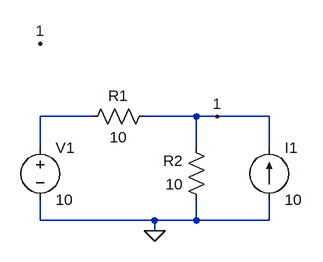
[diagram p0: schematic circuit-3.asc]
circuit-3.asc, the LTspice schematic file:
Version 4
SHEET 1 880 680
WIRE 80 112 0 112
WIRE 240 112 160 112
WIRE 272 112 240 112
WIRE 352 112 272 112
WIRE 0 160 0 112
WIRE 240 160 240 112
WIRE 352 160 352 112
WIRE 0 272 0 240
WIRE 176 272 0 272
WIRE 240 272 240 240
WIRE 240 272 176 272
WIRE 352 272 352 240
WIRE 352 272 240 272
WIRE 176 288 176 272
FLAG 176 288 0
FLAG 272 112 1
FLAG 0 0 1
SYMBOL res 176 96 R90
WINDOW 0 0 56 VBottom 2
WINDOW 3 32 56 VTop 2
SYMATTR InstName R1
SYMATTR Value 10
SYMBOL res 256 256 R180
WINDOW 0 36 76 Left 2
WINDOW 3 36 40 Left 2
SYMATTR InstName R2
SYMATTR Value 10
SYMBOL voltage 0 144 R0
WINDOW 123 0 0 Left 2
WINDOW 39 0 0 Left 2
SYMATTR InstName V1
SYMATTR Value 10
SYMBOL current 352 240 M180
WINDOW 0 24 80 Left 2
WINDOW 3 24 0 Left 2
SYMATTR InstName I1
SYMATTR Value 10

The netlist it stands for:
* circuit-3.asc
R1 1 N001 10
R2 0 1 10
V1 N001 0 10
I1 0 1 10
.backanno
.end